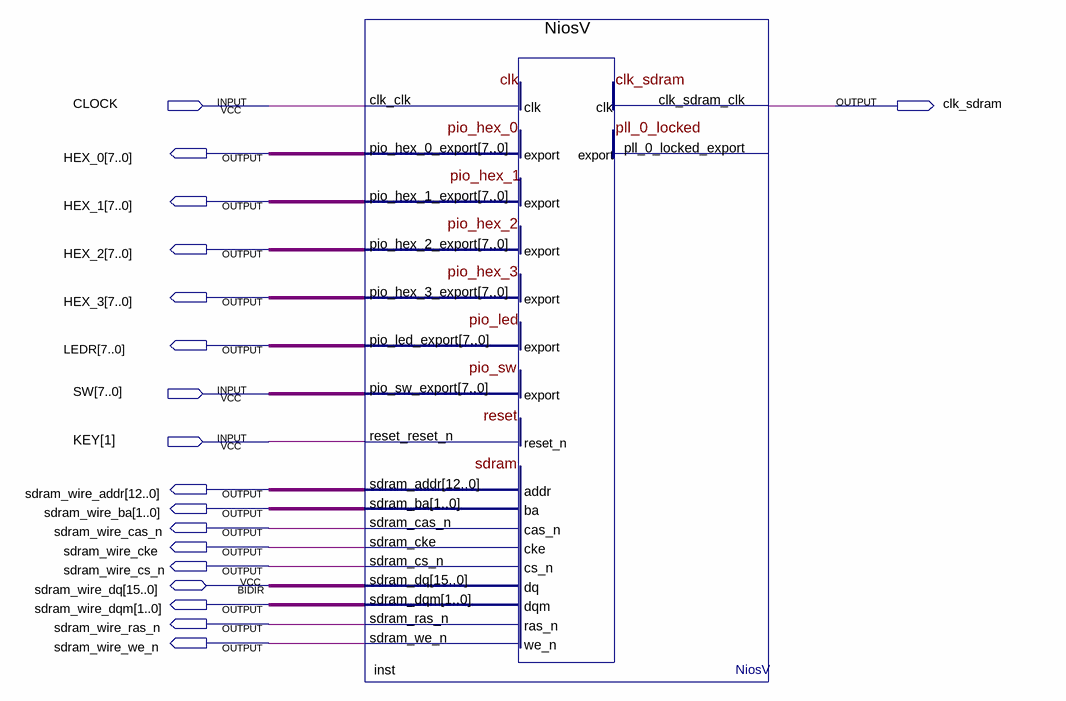
[diagram p0: schematic sheet]
// Quartus schematic NiosV_top.bdf as structural Verilog: 1 symbols, 18 pins
module NiosV_top (
  input  CLOCK,
  input  [7:0] SW,
  input  [1:1] KEY,
  inout  [15:0] sdram_wire_dq,
  output clk_sdram,
  output [7:0] HEX_0,
  output [7:0] HEX_1,
  output [7:0] HEX_2,
  output [7:0] HEX_3,
  output [7:0] LEDR,
  output [12:0] sdram_wire_addr,
  output [1:0] sdram_wire_ba,
  output sdram_wire_cas_n,
  output sdram_wire_cke,
  output sdram_wire_cs_n,
  output [1:0] sdram_wire_dqm,
  output sdram_wire_ras_n,
  output sdram_wire_we_n
);

  NiosV inst (
    .clk_clk(CLOCK), .pio_sw_export(SW), .reset_reset_n(KEY[1]), .clk_sdram_clk(clk_sdram),
    .pio_hex_0_export(HEX_0), .pio_hex_1_export(HEX_1), .pio_hex_2_export(HEX_2), .pio_hex_3_export(HEX_3),
    .pio_led_export(LEDR), .sdram_addr(sdram_wire_addr), .sdram_ba(sdram_wire_ba),
    .sdram_cas_n(sdram_wire_cas_n), .sdram_cke(sdram_wire_cke), .sdram_cs_n(sdram_wire_cs_n),
    .sdram_dqm(sdram_wire_dqm), .sdram_ras_n(sdram_wire_ras_n), .sdram_we_n(sdram_wire_we_n),
    .sdram_dq(sdram_wire_dq));  // open: pll_0_locked_export
endmodule
